# EAGLE schematic mainboard (EAGLE 7.1.0)
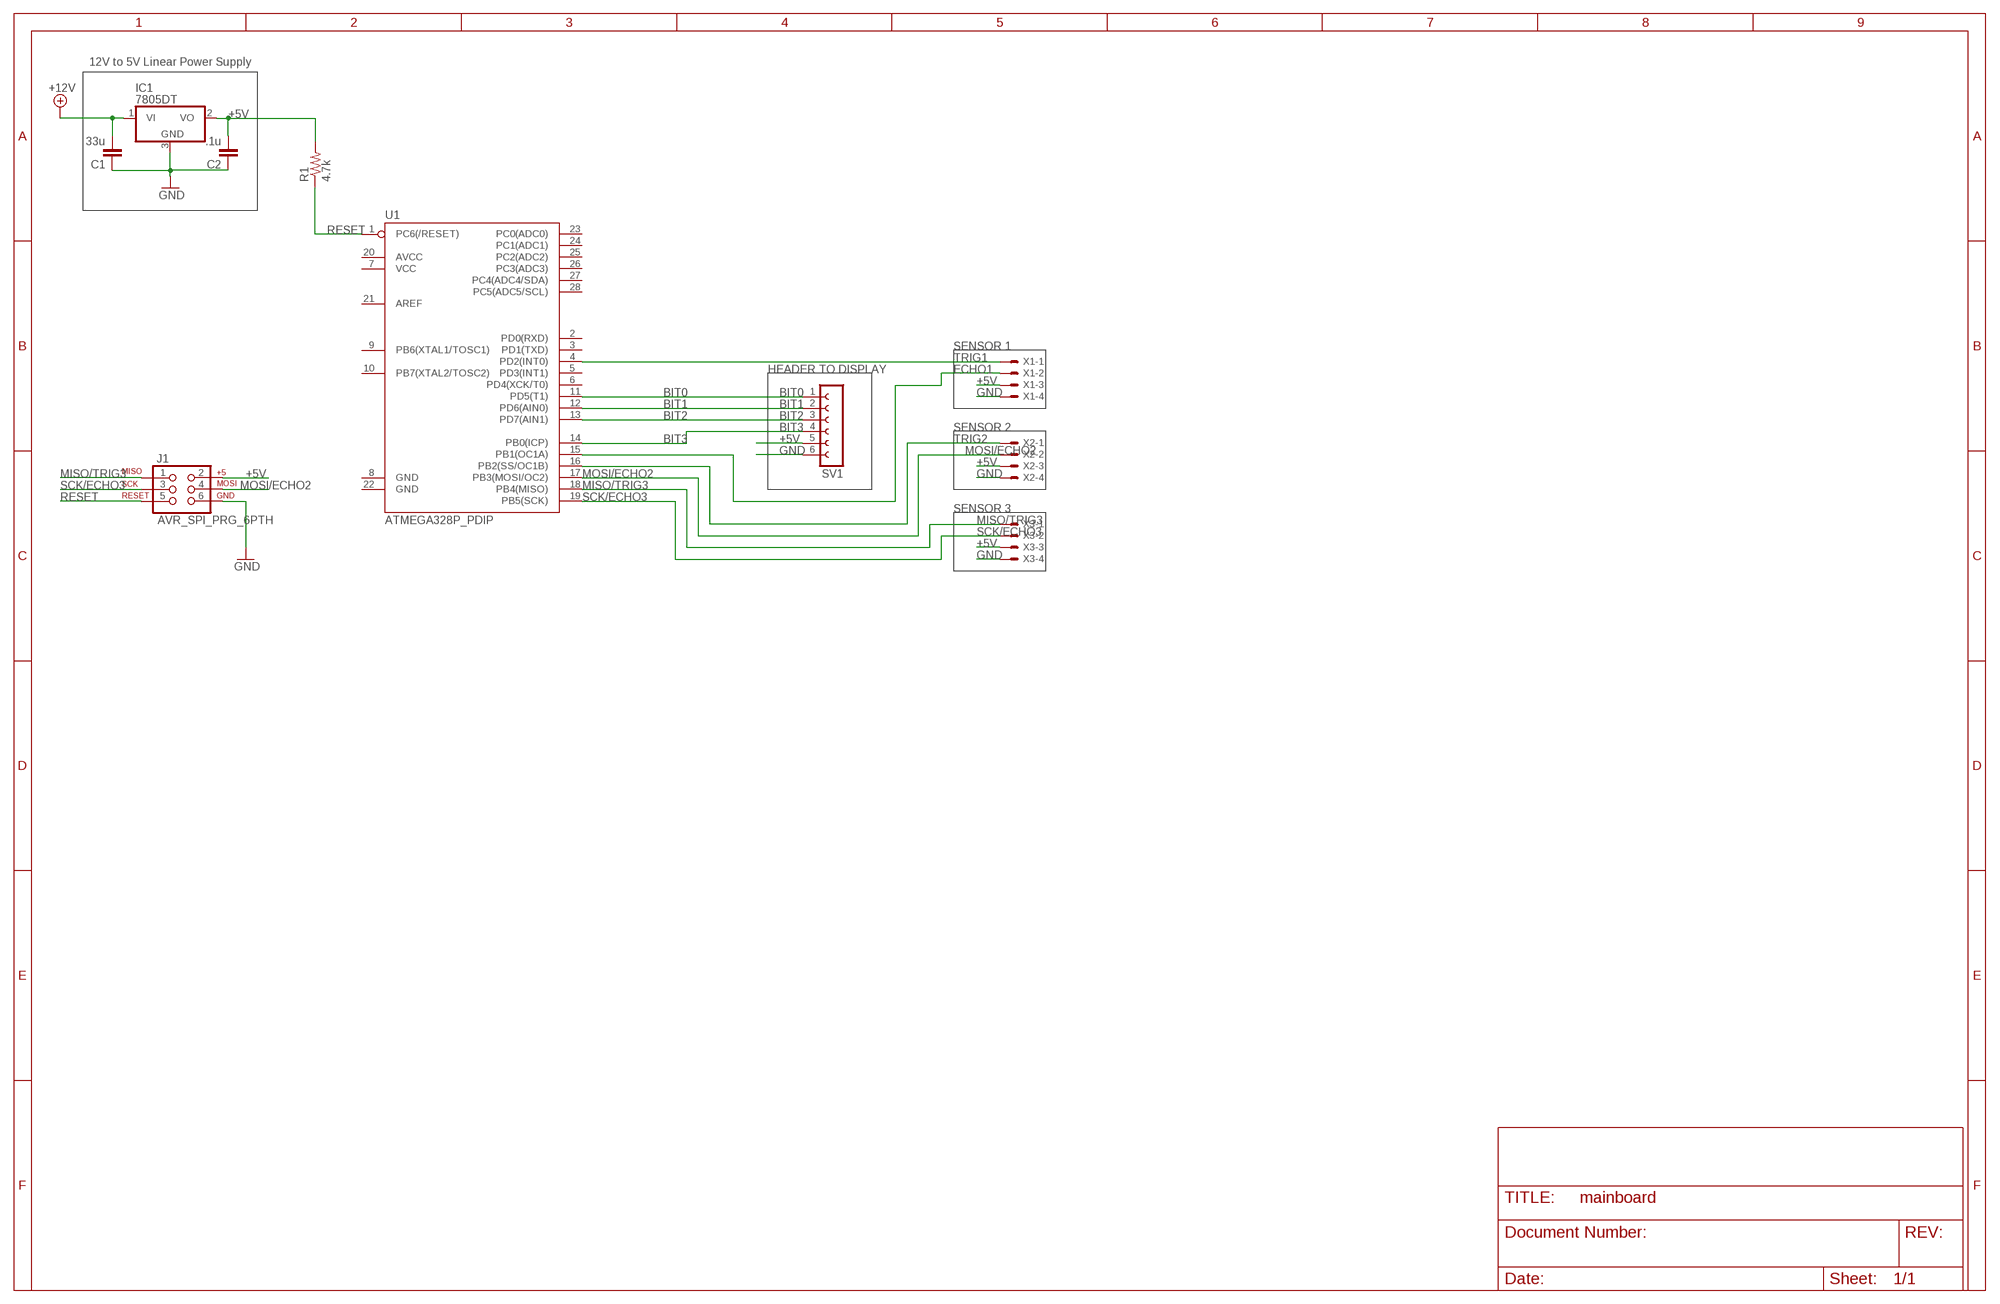
[diagram p0: schematic, sheet 1]

## Parts
C1  33u  C-EU025-024X044  [C025-024X044]
C2  .1u  C-EU025-024X044  [C025-024X044]
IC1  7805DT  [TO252]
J1  AVR_SPI_PRG_6PTH  [2X3]
R1  4.7k  R-US_0414/5V  [0414V]
SV1  FE06-1  [FE06]
U1  ATMEGA328P_PDIP  [DIL28-3]
X1  KK-156-4  [KK-156-4]
X2  KK-156-4  [KK-156-4]
X3  KK-156-4  [KK-156-4]

## Nets
+5V: C2.2 IC1.2(VO) J1.2 R1.2 SV1.5 X1.3 X2.3 X3.3
+12V: C1.2 IC1.1(VI)
BIT0: SV1.1 U1.11(PD5(T1))
BIT1: SV1.2 U1.12(PD6(AIN0))
BIT2: SV1.3 U1.13(PD7(AIN1))
BIT3: SV1.4 U1.14(PB0(ICP))
ECHO1: U1.15(PB1(OC1A)) X1.2
GND: C1.1 C2.1 IC1.3(GND) J1.6 SV1.6 X1.4 X2.4 X3.4
MISO/TRIG3: J1.1 U1.18(PB4(MISO)) X3.1
MOSI/ECHO2: J1.4 U1.17(PB3(MOSI/OC2)) X2.2
RESET: J1.5 R1.1 U1.1(PC6(/RESET))
SCK/ECHO3: J1.3 U1.19(PB5(SCK)) X3.2
TRIG1: U1.4(PD2(INT0)) X1.1
TRIG2: U1.16(PB2(SS/OC1B)) X2.1
Unconnected: U1.2(PD0(RXD)) U1.3(PD1(TXD)) U1.5(PD3(INT1)) U1.6(PD4(XCK/T0)) U1.7(VCC) U1.8(GND) U1.9(PB6(XTAL1/TOSC1)) U1.10(PB7(XTAL2/TOSC2)) U1.20(AVCC) U1.21(AREF) U1.22(GND) U1.23(PC0(ADC0)) U1.24(PC1(ADC1)) U1.25(PC2(ADC2)) U1.26(PC3(ADC3)) U1.27(PC4(ADC4/SDA)) U1.28(PC5(ADC5/SCL))

## Notes on the sheet
- 12V to 5V Linear Power Supply
- SENSOR 1
- HEADER TO DISPLAY
- SENSOR 2
- SENSOR 3

## Library data of the parts
C1 C2 = rcl:C-EU: CAPACITOR, European symbol
IC1 = linear:78*: Positive VOLTAGE REGULATOR Source: http://cache.national.com/ds/LM/LM78L05.pdf http://www.fairchildsemi.com/ds/LM/LM7805.pdf
J1 = SparkFun-Connectors:AVR_SPI_PRG_6: AVR ISP 6 Pin This is the reduced ISP connector for AVR programming. Common on Arduino. This footprint will take up less PCB space and can be used with a 10-pin to 6-pin adapter such as SKU: BOB-08508 **Special note about "TEST_POINT" package. The stop mask is on the top side, so if you want your programming test points to be on the bottom of your board, make sure to place this package on the bottom side of the board. This also ensure that the orientation to program from the bottom side will be correct.
R1 = rcl:R-US_: RESISTOR, American symbol
SV1 = con-lsta:FE06-1: FEMALE HEADER; OC_FARNELL: unknown; OC_NEWARK: unknown
U1 = SparkFun-DigitalIC:ATMEGA328P_PDIP: uC used in the Arduino 32kb flash, 1k EEPROM, 2k SRAM This is the through-hole version of this chip.
X1-X3 = con-molex:KK-156-4: KK 156 HEADER Source: http://www.molex.com/pdm_docs/sd/026604100_sd.pdf; OC_FARNELL: unknown; OC_NEWARK: unknown